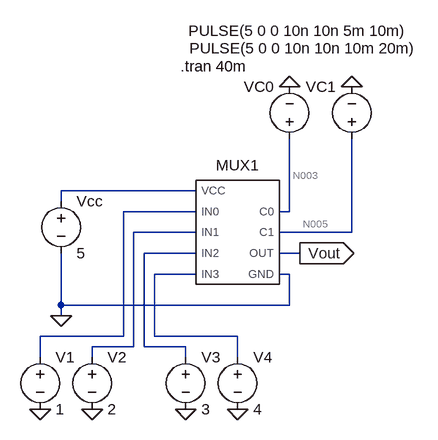
[diagram p0: schematic mux_counter.asc]
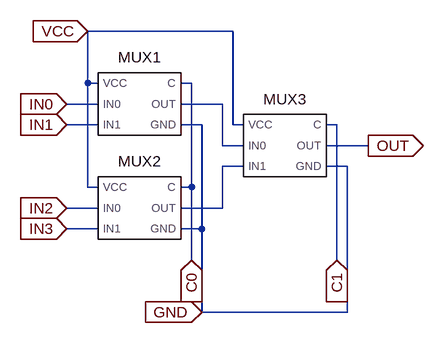
[diagram p1: sub-circuit mux_4to1.asc]
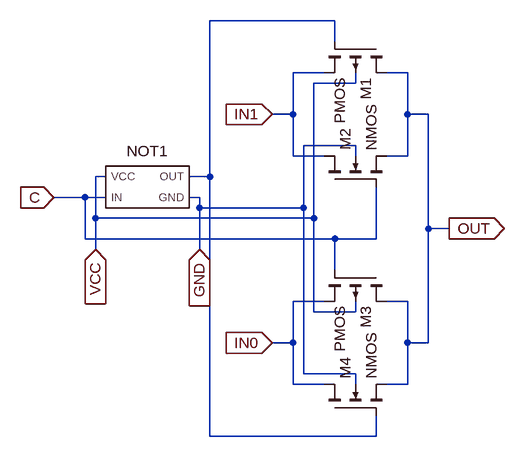
[diagram p2: sub-circuit mux_2to1.asc]
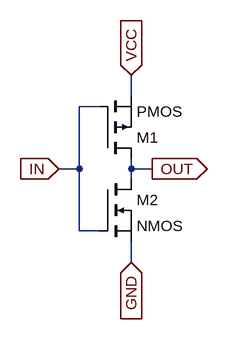
[diagram p3: sub-circuit not.asc]
mux_counter.asc, the LTspice schematic file:
Version 4.1
SHEET 1 880 680
WIRE 128 112 -80 112
WIRE -80 128 -80 112
WIRE 128 144 16 144
WIRE 272 144 272 32
WIRE 272 144 256 144
WIRE 128 176 32 176
WIRE 368 176 368 32
WIRE 368 176 256 176
WIRE 128 208 48 208
WIRE 288 208 256 208
WIRE 128 240 64 240
WIRE 272 240 256 240
WIRE -80 288 -80 208
WIRE 272 288 272 240
WIRE 272 288 -80 288
WIRE -80 304 -80 288
WIRE 16 336 16 144
WIRE 16 336 -112 336
WIRE 64 336 64 240
WIRE 192 336 64 336
WIRE 32 352 32 176
WIRE 32 352 -32 352
WIRE 48 352 48 208
WIRE 112 352 48 352
WIRE -112 368 -112 336
WIRE -32 368 -32 352
WIRE 112 368 112 352
WIRE 192 368 192 336
FLAG -80 304 0
FLAG -112 448 0
FLAG -32 448 0
FLAG 112 448 0
FLAG 192 448 0
FLAG 288 208 Vout
IOPIN 288 208 Out
FLAG 272 -48 0
FLAG 368 -48 0
SYMBOL mux_4to1 192 176 R0
SYMATTR InstName MUX1
SYMBOL voltage -80 112 R0
SYMATTR InstName Vcc
SYMATTR Value 5
SYMBOL voltage -112 352 R0
SYMATTR InstName V1
SYMATTR Value 1
SYMBOL voltage -32 352 R0
SYMATTR InstName V2
SYMATTR Value 2
SYMBOL voltage 112 352 R0
SYMATTR InstName V3
SYMATTR Value 3
SYMBOL voltage 192 352 R0
SYMATTR InstName V4
SYMATTR Value 4
SYMBOL voltage 272 48 R180
WINDOW 0 24 96 Left 2
WINDOW 3 -182 182 Left 2
WINDOW 123 0 0 Left 0
WINDOW 39 0 0 Left 0
SYMATTR InstName VC0
SYMATTR Value PULSE(5 0 0 10n 10n 5m 10m)
SYMBOL voltage 368 48 R180
WINDOW 0 24 96 Left 2
WINDOW 3 -101 155 Left 2
SYMATTR InstName VC1
SYMATTR Value PULSE(5 0 0 10n 10n 10m 20m)
TEXT 104 -80 Left 2 !.tran 40m

mux_4to1.asc, the sub-circuit schematic file:
Version 4.1
SHEET 1 880 680
WIRE 336 32 112 32
WIRE 112 112 112 32
WIRE 128 112 112 112
WIRE 272 112 256 112
WIRE 128 144 80 144
WIRE 320 144 256 144
WIRE 128 176 80 176
WIRE 288 176 256 176
WIRE 336 176 336 32
WIRE 352 176 336 176
WIRE 496 176 480 176
WIRE 320 208 320 144
WIRE 352 208 320 208
WIRE 544 208 480 208
WIRE 352 240 320 240
WIRE 512 240 480 240
WIRE 112 272 112 112
WIRE 128 272 112 272
WIRE 272 272 272 112
WIRE 272 272 256 272
WIRE 128 304 80 304
WIRE 320 304 320 240
WIRE 320 304 256 304
WIRE 128 336 80 336
WIRE 288 336 288 176
WIRE 288 336 256 336
WIRE 272 384 272 272
WIRE 496 384 496 176
WIRE 288 464 288 336
WIRE 512 464 512 240
WIRE 512 464 288 464
FLAG 112 32 VCC
IOPIN 112 32 In
FLAG 288 464 GND
IOPIN 288 464 In
FLAG 272 384 C0
IOPIN 272 384 In
FLAG 496 384 C1
IOPIN 496 384 In
FLAG 544 208 OUT
IOPIN 544 208 Out
FLAG 80 336 IN3
IOPIN 80 336 In
FLAG 80 304 IN2
IOPIN 80 304 In
FLAG 80 176 IN1
IOPIN 80 176 In
FLAG 80 144 IN0
IOPIN 80 144 In
SYMBOL mux_2to1 192 144 R0
SYMATTR InstName MUX1
SYMBOL mux_2to1 192 304 R0
SYMATTR InstName MUX2
SYMBOL mux_2to1 416 208 R0
SYMATTR InstName MUX3

mux_2to1.asc, the sub-circuit schematic file:
Version 4.1
SHEET 1 880 696
WIRE 192 48 0 48
WIRE 192 80 192 48
WIRE 176 128 128 128
WIRE 304 128 272 128
WIRE 224 144 224 128
WIRE 224 144 160 144
WIRE 128 192 128 128
WIRE 128 192 96 192
WIRE 304 192 304 128
WIRE 336 192 304 192
WIRE 224 240 144 240
WIRE 128 256 128 192
WIRE 176 256 128 256
WIRE 224 256 224 240
WIRE 304 256 304 192
WIRE 304 256 272 256
WIRE -160 288 -176 288
WIRE 0 288 0 48
WIRE 0 288 -32 288
WIRE -192 320 -240 320
WIRE -160 320 -192 320
WIRE -16 320 -32 320
WIRE -16 336 -16 320
WIRE 144 336 144 240
WIRE 144 336 -16 336
WIRE -176 352 -176 288
WIRE 160 352 160 144
WIRE 160 352 -176 352
WIRE 336 368 336 192
WIRE 368 368 336 368
WIRE -192 384 -192 320
WIRE 192 384 -192 384
WIRE 256 384 256 304
WIRE 256 384 192 384
WIRE -176 400 -176 352
WIRE -16 400 -16 336
WIRE 192 432 192 384
WIRE 176 480 128 480
WIRE 304 480 272 480
WIRE 160 496 160 352
WIRE 224 496 224 480
WIRE 224 496 160 496
WIRE 128 544 128 480
WIRE 128 544 96 544
WIRE 304 544 304 480
WIRE 336 544 336 368
WIRE 336 544 304 544
WIRE 144 592 144 336
WIRE 224 592 144 592
WIRE 128 608 128 544
WIRE 176 608 128 608
WIRE 224 608 224 592
WIRE 304 608 304 544
WIRE 304 608 272 608
WIRE 0 688 0 288
WIRE 256 688 256 656
WIRE 256 688 0 688
FLAG 368 368 OUT
IOPIN 368 368 Out
FLAG 96 192 IN1
IOPIN 96 192 In
FLAG 96 544 IN0
IOPIN 96 544 In
FLAG -240 320 C
IOPIN -240 320 In
FLAG -176 400 VCC
IOPIN -176 400 In
FLAG -16 400 GND
IOPIN -16 400 In
SYMBOL not -96 304 R0
SYMATTR InstName NOT1
SYMBOL pmos4 272 80 R90
SYMATTR InstName M1
SYMBOL pmos4 272 432 R90
SYMATTR InstName M3
SYMBOL nmos4 176 304 R270
SYMATTR InstName M2
SYMBOL nmos4 176 656 R270
SYMATTR InstName M4

not.asc, the sub-circuit schematic file:
Version 4.1
SHEET 1 880 680
WIRE 176 48 176 16
WIRE 128 64 96 64
WIRE 96 160 96 64
WIRE 96 160 64 160
WIRE 176 160 176 144
WIRE 208 160 176 160
WIRE 176 176 176 160
WIRE 96 256 96 160
WIRE 128 256 96 256
WIRE 176 304 176 272
FLAG 64 160 IN
IOPIN 64 160 In
FLAG 208 160 OUT
IOPIN 208 160 Out
FLAG 176 16 VCC
IOPIN 176 16 In
FLAG 176 304 GND
IOPIN 176 304 In
SYMBOL pmos 128 144 M180
SYMATTR InstName M1
SYMBOL nmos 128 176 R0
SYMATTR InstName M2

The netlist it stands for:
* mux_counter.asc
X§MUX1 N003 N005 0 N002 N004 N006 N007 N001 Vout mux_4to1
Vcc N001 0 5
V1 N002 0 1
V2 N004 0 2
V3 N006 0 3
V4 N007 0 4
VC0 N003 0 PULSE(5 0 0 10n 10n 5m 10m)
VC1 N005 0 PULSE(5 0 0 10n 10n 10m 20m)

* block symbol definitions
.subckt mux_4to1 C0 C1 GND IN0 IN1 IN2 IN3 VCC OUT
X§MUX1 C0 GND IN0 IN1 VCC N001 mux_2to1
X§MUX2 C0 GND IN2 IN3 VCC N002 mux_2to1
X§MUX3 C1 GND N001 N002 VCC OUT mux_2to1
.ends mux_4to1

.subckt mux_2to1 C GND IN0 IN1 VCC OUT
X§NOT1 GND C VCC N001 not
M1 OUT N001 IN1 VCC PMOS
M3 OUT C IN0 VCC PMOS
M2 IN1 C OUT GND NMOS
M4 IN0 N001 OUT GND NMOS
.ends mux_2to1

.subckt not GND IN VCC OUT
M1 OUT IN VCC VCC PMOS
M2 OUT IN GND GND NMOS
.ends not

.model NMOS NMOS
.model PMOS PMOS
.lib standard.mos
.tran 40m
.backanno
.end

* Results of the author's LTspice run, read from the files saved beside the schematic
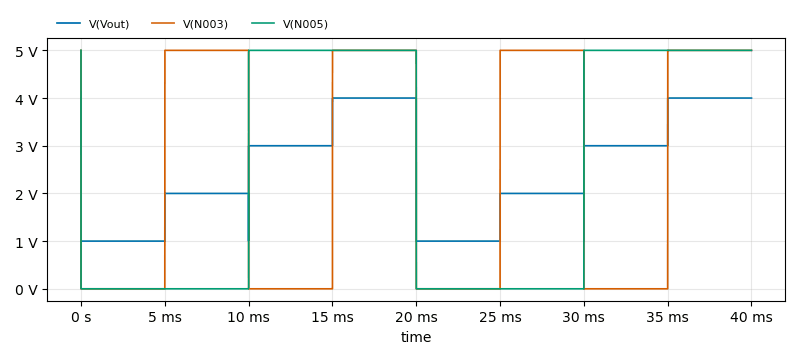
[diagram p4: Transient Analysis of mux_counter.asc, plotted from the saved traces]
* Transient Analysis, 1 run:
*   V(Vout): min 999.9 mV, max 4 V, average 2.5 V, rms 2.739 V, last 4 V
*   V(N003): min 0 V, max 5 V, average 2.5 V, rms 3.536 V, last 5 V
*   V(N005): min 0 V, max 5 V, average 2.5 V, rms 3.536 V, last 5 V